# Altium schematic sheet main.SchDoc
size A; SheetNumber: 1; SheetTotal: 2; SPICEModelCacheWNGBZOPR: <root> / <DocumentId>WNGBZOPR</DocumentId> / <CacheFrame Number="0"> / <Model Name="cap" Kind="MDL"> / <Text>*Default semiconductor capacitor / .MODEL CAP C()</Text> / </Model> / </CacheFrame> / </root>
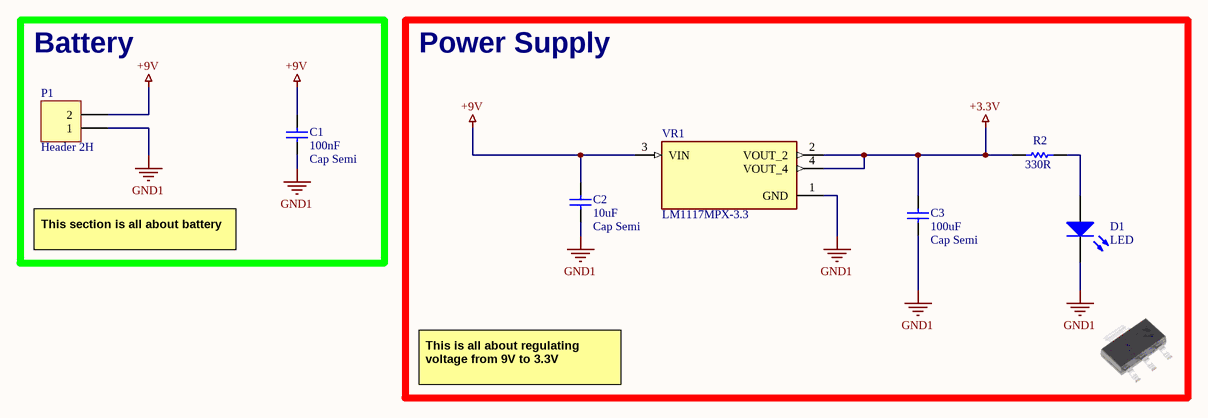
[diagram p0: main.SchDoc]

## Parts
C1  Cap Semi  value 100nF  [C1206]
C2  Cap Semi  value 10uF  [C1206]
C3  Cap Semi  value 100uF  [C1206]
D1  LED  [MY_LED_0805]
P1  Header 2H  [HDR1X2H]
R2  330R  [MY_0805]
VR1  LM1117MPX-3.3  [VREG_LM1117MPX-3.3]

## Blocks framed on the sheet
Battery: C1 P1
Power Supply: C2 C3 D1 R2 VR1

## Nets
+3.3V: C3.2 R2.1 VR1.2(VOUT_2) VR1.4(VOUT_4)
+9V: C1.2 C2.2 P1.2 VR1.3(VIN)
GND1: C1.1 C2.1 C3.1 D1.K P1.1 VR1.1(GND)
NetD1_A: D1.A R2.2

## Notes on the sheet
- This section is all about battery
- This is all about regulating voltage from 9V to 3.3V

## Library data of the parts
C1-C3 = Cap Semi: Capacitor (Semiconductor SIM Model); Published: 8-Jun-2000; LatestRevisionDate: 29-May-2009; LatestRevisionNote: IPC-7351 Footprint Added.; PackageReference: C1206; Publisher: Altium Limited; PackageDescription: Chip Capacitor
D1 = LED: Typical INFRARED GaAs LED; ASiD Part Number: LED-AS
P1 = Header 2H: Header, 2-Pin, Right Angle; LatestRevisionDate: 17-Jul-2002; LatestRevisionNote: Re-released for DXP Platform.; Publisher: Altium Limited
R2 = Res: Standard resistor; ASiD Part Number: Res-AS; Value: 330R
VR1 = LM1117MPX-3.3: 800-mA 15-V linear voltage regulator; MF: Texas Instruments; Check_prices: https://www.snapeda.com/parts/LM1117MPX-3.3/Texas+Instruments/view-part/?ref=eda; Value: *; Availability: In Stock; MP: LM1117MPX-3.3; Price: None; Package: SOT-223-4 Texas Instruments; SnapEDA_Link: https://www.snapeda.com/parts/LM1117MPX-3.3/Texas+Instruments/view-part/?ref=snap; Purchase-URL: https://pricing.snapeda.com/search/part/LM1117MPX-3.3/?ref=eda